# Altium schematic sheet SD Holder.SchDoc
size A4
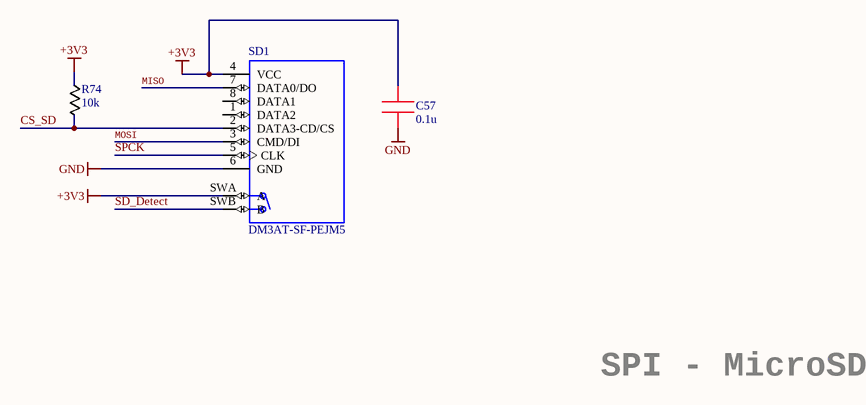
[diagram p0: SD Holder.SchDoc]

## Parts
C57  0.1u  [0603 CAP]
R74  10k  [0603 - RES]
SD1  DM3AT-SF-PEJM5  [DM3AT-SF-PEJM5]

## Nets
+3V3: C57.2 R74.1 SD1.4(VCC) SD1.SWA(A)
GND: C57.1 SD1.6(GND)
CS_SD: R74.2 SD1.2(DATA3-CD/CS)
MISO: SD1.7(DATA0/DO)
MOSI: SD1.3(CMD/DI)
SD_Detect: SD1.SWB(B)
SPCK: SD1.5(CLK)

Not connected (* = marked no-connect by the designer): SD1 1(DATA2) 8(DATA1)

## Notes on the sheet
- SPI - MicroSD

## Library data of the parts
C57 = 0603 CAP: GRM188R71E104KA01D
R74 = 0603 RES: RC0603JR-0710K